# Altium schematic sheet 02-ZYNQ BANK 0.SchDoc
size 513 x 386 mm
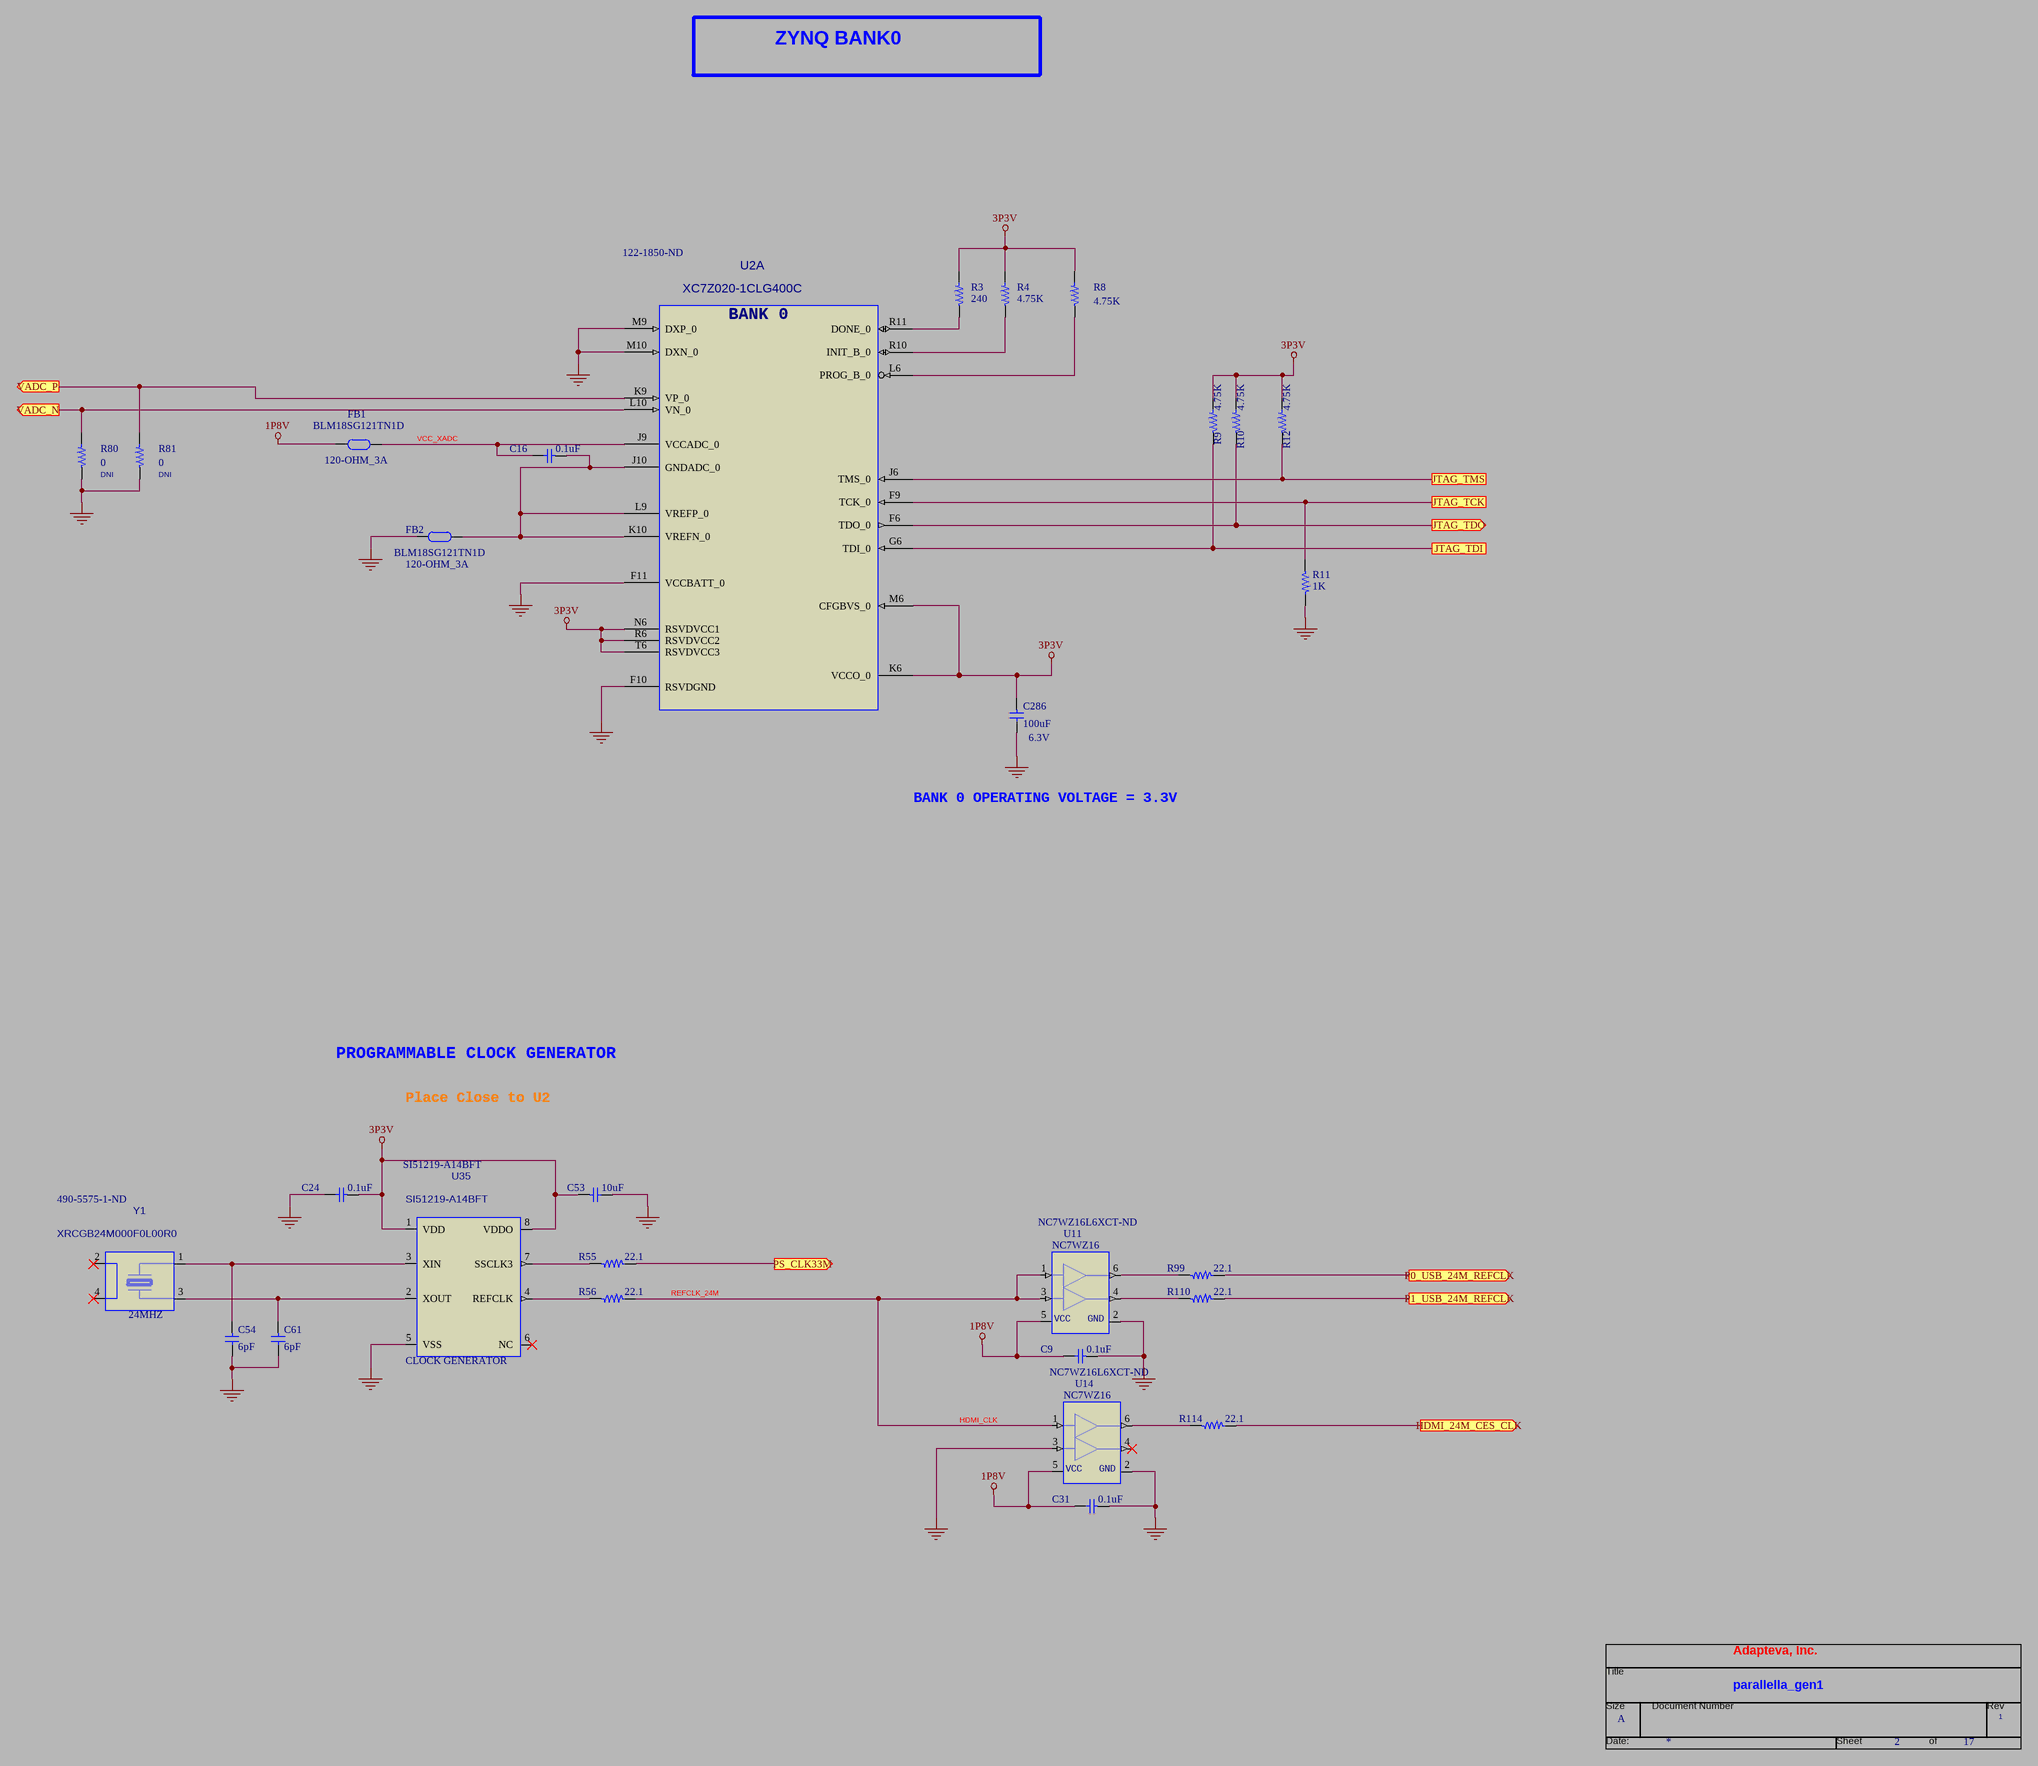
[diagram p0: 02-ZYNQ BANK 0.SchDoc]

## Parts
*  RevCode: 1  Title: parallella_gen1  Page Size: A  Page Number: 2  Page Count: 17  OrgAddr1: Adapteva, Inc.  (hidden comment: TitleBlock0)  (graphical)
C9  0.1uF  [C0402]
C16  0.1uF  [C0402]
C24  0.1uF  [C0402]
C31  0.1uF  [C0402]
C53  10uF  [C0603]
C54  6pF  [C0402]
C61  6pF  [C0402]
C286  100uF  VOLTAGE: 6.3V  [C1210]
FB1  120-OHM_3A  [BEAD_0603]
FB2  120-OHM_3A  [BEAD_0603]
R3  240  [R0402]
R4  4.75K  [R0402]
R8  4.75K  [R0402]
R9  4.75K  [R0402]
R10  4.75K  [R0402]
R11  1K  [R0402]
R12  4.75K  [R0402]
R55  22.1  [R0402]
R56  22.1  [R0402]
R80  0  INSTALL: DNI  [R0402]
R81  0  INSTALL: DNI  [R0402]
R99  22.1  [R0402]
R110  22.1  [R0402]
R114  22.1  [R0402]
U2  Vendor PN: XC7Z020-1CLG400C  Supplier Part Number 1: 122-1850-ND  [CBGA400_17SQ_1P6H_P8MMP]  (hidden comment: 7Z020-CLG400)  (part A of 8)
U11  NC7WZ16  Supplier Part Number 1: NC7WZ16L6XCT-ND  [SC_70_6PSMT]
U14  NC7WZ16  Supplier Part Number 1: NC7WZ16L6XCT-ND  [SC_70_6PSMT]
U35  CLOCK GENERATOR  MFG PART NO: SI51219-A14BFT  [TSSOP8_3X4P4X1P2H_P65MMP]
Y1  24MHZ  Vendor PN: XRCGB24M000F0L00R0  Supplier Part Number 1: 490-5575-1-ND  [OSC4_1P6X2X7MMH]

## Ports
HDMI_24M_CES_CLK (out), JTAG_TCK, JTAG_TDI, JTAG_TDO (out), JTAG_TMS, P0_USB_24M_REFCLK (out), P1_USB_24M_REFCLK (out), PS_CLK33M (out), VADC_N (out), VADC_P (out)

## Nets
1P8V: C9.2 C31.2 FB1.1 U11.5(VCC) U14.5(VCC)
3P3V: C24.1 C53.1 C286.1 R3.2 R4.2 R8.2 R9.2 R10.2 R12.2 U2.K6(VCCO_0) U2.M6(CFGBVS_0) U2.N6(RSVDVCC1) U2.R6(RSVDVCC2) U2.T6(RSVDVCC3) U35.1(VDD) U35.8(VDDO)
GND: C9.1 C24.2 C31.1 C53.2 C54.2 C61.2 C286.2 FB2.1 R11.2 R80.1 R81.1 U2.F10(RSVDGND) U2.F11(VCCBATT_0) U2.M9(DXP_0) U2.M10(DXN_0) U11.2(GND) U14.2(GND) U14.3(A2) U35.5(VSS)
HDMI_24M_CES_CLK: R114.2 ; port HDMI_24M_CES_CLK
HDMI_CLK: R56.2 U11.1(A1) U11.3(A2) U14.1(A1)  [also labelled REFCLK_24M]
JTAG_TCK: R11.1 U2.F9(TCK_0) ; port JTAG_TCK
JTAG_TDI: R9.1 U2.G6(TDI_0) ; port JTAG_TDI
JTAG_TDO: R10.1 U2.F6(TDO_0) ; port JTAG_TDO
JTAG_TMS: R12.1 U2.J6(TMS_0) ; port JTAG_TMS
P0_USB_24M_REFCLK: R99.2 ; port P0_USB_24M_REFCLK
P1_USB_24M_REFCLK: R110.2 ; port P1_USB_24M_REFCLK
PS_CLK33M: R55.2 ; port PS_CLK33M
VADC_N: R80.2 U2.L10(VN_0) ; port VADC_N
VADC_P: R81.2 U2.K9(VP_0) ; port VADC_P
VCC_XADC: C16.2 FB1.2 U2.J9(VCCADC_0)
NetC16_1: C16.1 FB2.2 U2.J10(GNDADC_0) U2.K10(VREFN_0) U2.L9(VREFP_0)
NetC54_1: C54.1 U35.3(XIN) Y1.1
NetC61_1: C61.1 U35.2(XOUT) Y1.3
NetR3_1: R3.1 U2.R11(DONE_0)
NetR4_1: R4.1 U2.R10(INIT_B_0)
NetR8_1: R8.1 U2.L6(PROG_B_0)
NetR55_1: R55.1 U35.7(SSCLK3)
NetR56_1: R56.1 U35.4(REFCLK)
NetR99_1: R99.1 U11.6(Y1)
NetR110_1: R110.1 U11.4(Y2)
NetR114_1: R114.1 U14.6(Y1)

Not connected (* = marked no-connect by the designer): U14 4(Y2)*; U35 6(NC)*; Y1 2* 4*

## Notes on the sheet
- ZYNQ BANK0
- BANK 0 OPERATING VOLTAGE = 3.3V
- PROGRAMMABLE CLOCK GENERATOR
- Place Close to U2
- (in symbol TitleBlock0) Title; Size; Document Number; Rev; Date:; Sheet; of
- (in symbol ZYNQ_7Z020_CLG400, part A) BANK 0

## Library data of the parts
C9 C16 C24 C31 = CAP0402_0P1UF_X5R_35V: CAP, 0402, 0.1UF, X5R, 35V; ALT_SYMBOLS: C0402_BGA; Vendor PN: GMK105BJ104KV-F; Vendor: TAIYO YUDEN; DEVICE: CAP0402_0P1UF_X5R_35V; MFG PART NO: GMK105BJ104KV-F; MFG: TAIYO YUDEN; PCB Footprint: C0402
C53 = CAP0603_10UF_X5R: CAP, 0603, 10UF, X5R, 10V; MFG PART NO: LMK107BJ106MALTD; MFG: TAIYO YUDEN; DEVICE: CAP0603_10UF_X5R; Vendor: TAIYO YUDEN; Vendor PN: LMK107BJ106MALTD; PCB Footprint: C0603
C54 C61 = CAP0402_6PF_NPO_50V: CAP, 0402, 6PF, NPO, 50V; ALT_SYMBOLS: C0402_BGA; Vendor PN: C1005COG1H060D050BA; Vendor: TDK; DEVICE: CAP0402_6PF_NPO_50V; MFG PART NO: C1005COG1H060D050BA; MFG: TDK; PCB Footprint: C0402
C286 = CAP1210_100UF_X5R_LOESR: CAP, 1210, 100UF, X5R, 6.3V, LOW ESR; MFG PART NO: GRM32ER60J107ME20L; MFG: MURATA; DEVICE: CAP1210_100UF_X5R_LOESR; Vendor: MURATA; Vendor PN: GRM32ER60J107ME20L; PCB Footprint: C1210
FB1 FB2 = BLM18SG121TN1D: FERRITE, BEAD, FILTER, 0603, 3A; Vendor: MURATA; PCB Footprint: FB0603; Vendor PN: BLM18SG121TN1D; DEVICE: BLM18SG121TN1D
R3 = RES0402_240: RES, 0402, 240, 1%; MFG PART NO: CRCW0402240RFKED; ALT_SYMBOLS: R0402_BGA; MFG: VISHAY; Vendor: VISHAY/DALE; DEVICE: RES0402_240; Vendor PN: CRCW0402240RFKED; PCB Footprint: R0402
R4 R8-R10 R12 = RES0402_4K75: RES, 0402, 4.75K, 1%; MFG PART NO: CRCW04024K75FKED; MFG: VISHAY; Vendor: VISHAY/DALE; ALT_SYMBOLS: R0402_BGA; DEVICE: RES0402_4K75; Vendor PN: CRCW04024K75FKED; PCB Footprint: R0402
R11 = RES0402_1K: RES, 0402, 1K; MFG PART NO: CRCW04021K00FKED; ALT_SYMBOLS: R0402_BGA; MFG: VISHAY; Vendor: VISHAY/DALE; DEVICE: RES0402_1K; Vendor PN: CRCW04021K00FKED; PCB Footprint: R0402
R55 R56 R99 R110 R114 = RES0402_22R1: RES, 0402, 22.1, 1%; MFG PART NO: CRCW040222R1FKED; MFG: VISHAY; Vendor: VISHAY/DALE; ALT_SYMBOLS: R0402_BGA; DEVICE: RES0402_22R1; Vendor PN: CRCW040222R1FKED; PCB Footprint: R0402
R80 R81 = RES0402_0: RES, 0402, 0 OHM, 1%; MFG PART NO: CRCW04020000Z0ED; ALT_SYMBOLS: R0402_BGA; MFG: VISHAY; Vendor: VISHAY/DALE; DEVICE: RES0402_0; Vendor PN: CRCW04020000Z0ED; PCB Footprint: R0402
U2 = ZYNQ_7Z020_CLG400: IC, EPP, XILINX, ZYNQ, 7Z020, CLG400; SPLIT_INST: TRUE; Vendor: XILINX; DEVICE: ZYNQ_7Z020_CLG400; PCB Footprint: CBGA400_17SQ_1P6H_P8MMP; Supplier 1: Digi-Key
U11 U14 = NC7WZ16: MFG PART NO: NC7WZ16P6X; MFG: FAIRCHILD; DEVICE: NC7WZ16; Vendor: FAIRCHILD; Vendor PN: NC7WZ16P6X; PCB Footprint: SC_70_6PSMT; Supplier 1: Digi-Key
U35 = IC_SI51219: IC, PROGRAMMABLE CLOCK GEN, 3 OUTPUTS, TSSOP8; MFG: SILICON LABS; Vendor: SILICON LABS; Vendor PN: SI51219-A14BFT; PCB Footprint: TSSOP8_3X4P4X1P2H_P65MMP; Supplier 1: Avnet; Supplier Part Number 1: SI51219-A14BFT
Y1 = CRYSTAL_4P_24MHZ: XTAL, 2X1.6MM, 24MHZ, 4PIN, SMT; Vendor: MURATA; DEVICE: CRYSTAL_4P_24MHZ; PCB Footprint: OSC4_1P6X2X7MMH; Supplier 1: Digi-Key
* = TitleBlock0: Page Create Date: March  8, 1995; Page Modify Date: *